# Altium project Sayma_AMC.PrjPcb (part 5 of 18)

## Sheet SDRAM_DDR3_2x16.SchDoc: Sayma AMC
size 420 x 297 mm; $$Internal___BlkDate: 0:12:25_2-9-18; $$Internal_NAME_PLACEHOLDER: a3sheet; $$Internal_Resolution: 00001mm; $$NotCommonProperty_@PRINTORDER: 3; $$NotCommonProperty_FORWARD_PCB: 0; $$NotCommonProperty_REVISION: 0; @DATETIME: 10-1-2003_18:26; @NAME: SDRAM_DDR3_2x16; @SHEET: 1; @SHEETTOTAL: 30; CmpIndex: 131; Drawing Author: G.Kasprowicz; Drawing Number: Sayma AMC; Drawing Project: AMC FMC Carrier Board; Drawing Revision: 2.0; SymIndex: 2141; CheckedBy: P.Kulik,T.Przywozki,W.Ruclo; Author: G.Kasprowicz; CompanyName: WUT ISE; DrawnBy: G.Kasprowicz; Organization: WUT ISE; Address1: PW ISE; Address2: Nowowiejska 15/19 00-665 Warsaw; Address3: gkasprow@gmail.com; DocumentNumber: 28; Revision: 2; SheetNumber: 28; SheetTotal: 32; ModifiedBy: -; CheckedDate: -; Title2: DDR3 - 32bit; DivGrp: WUT ISE; Designer: G.Kasprowicz; ModifiedDate: -; ProjectName: Sensor Box
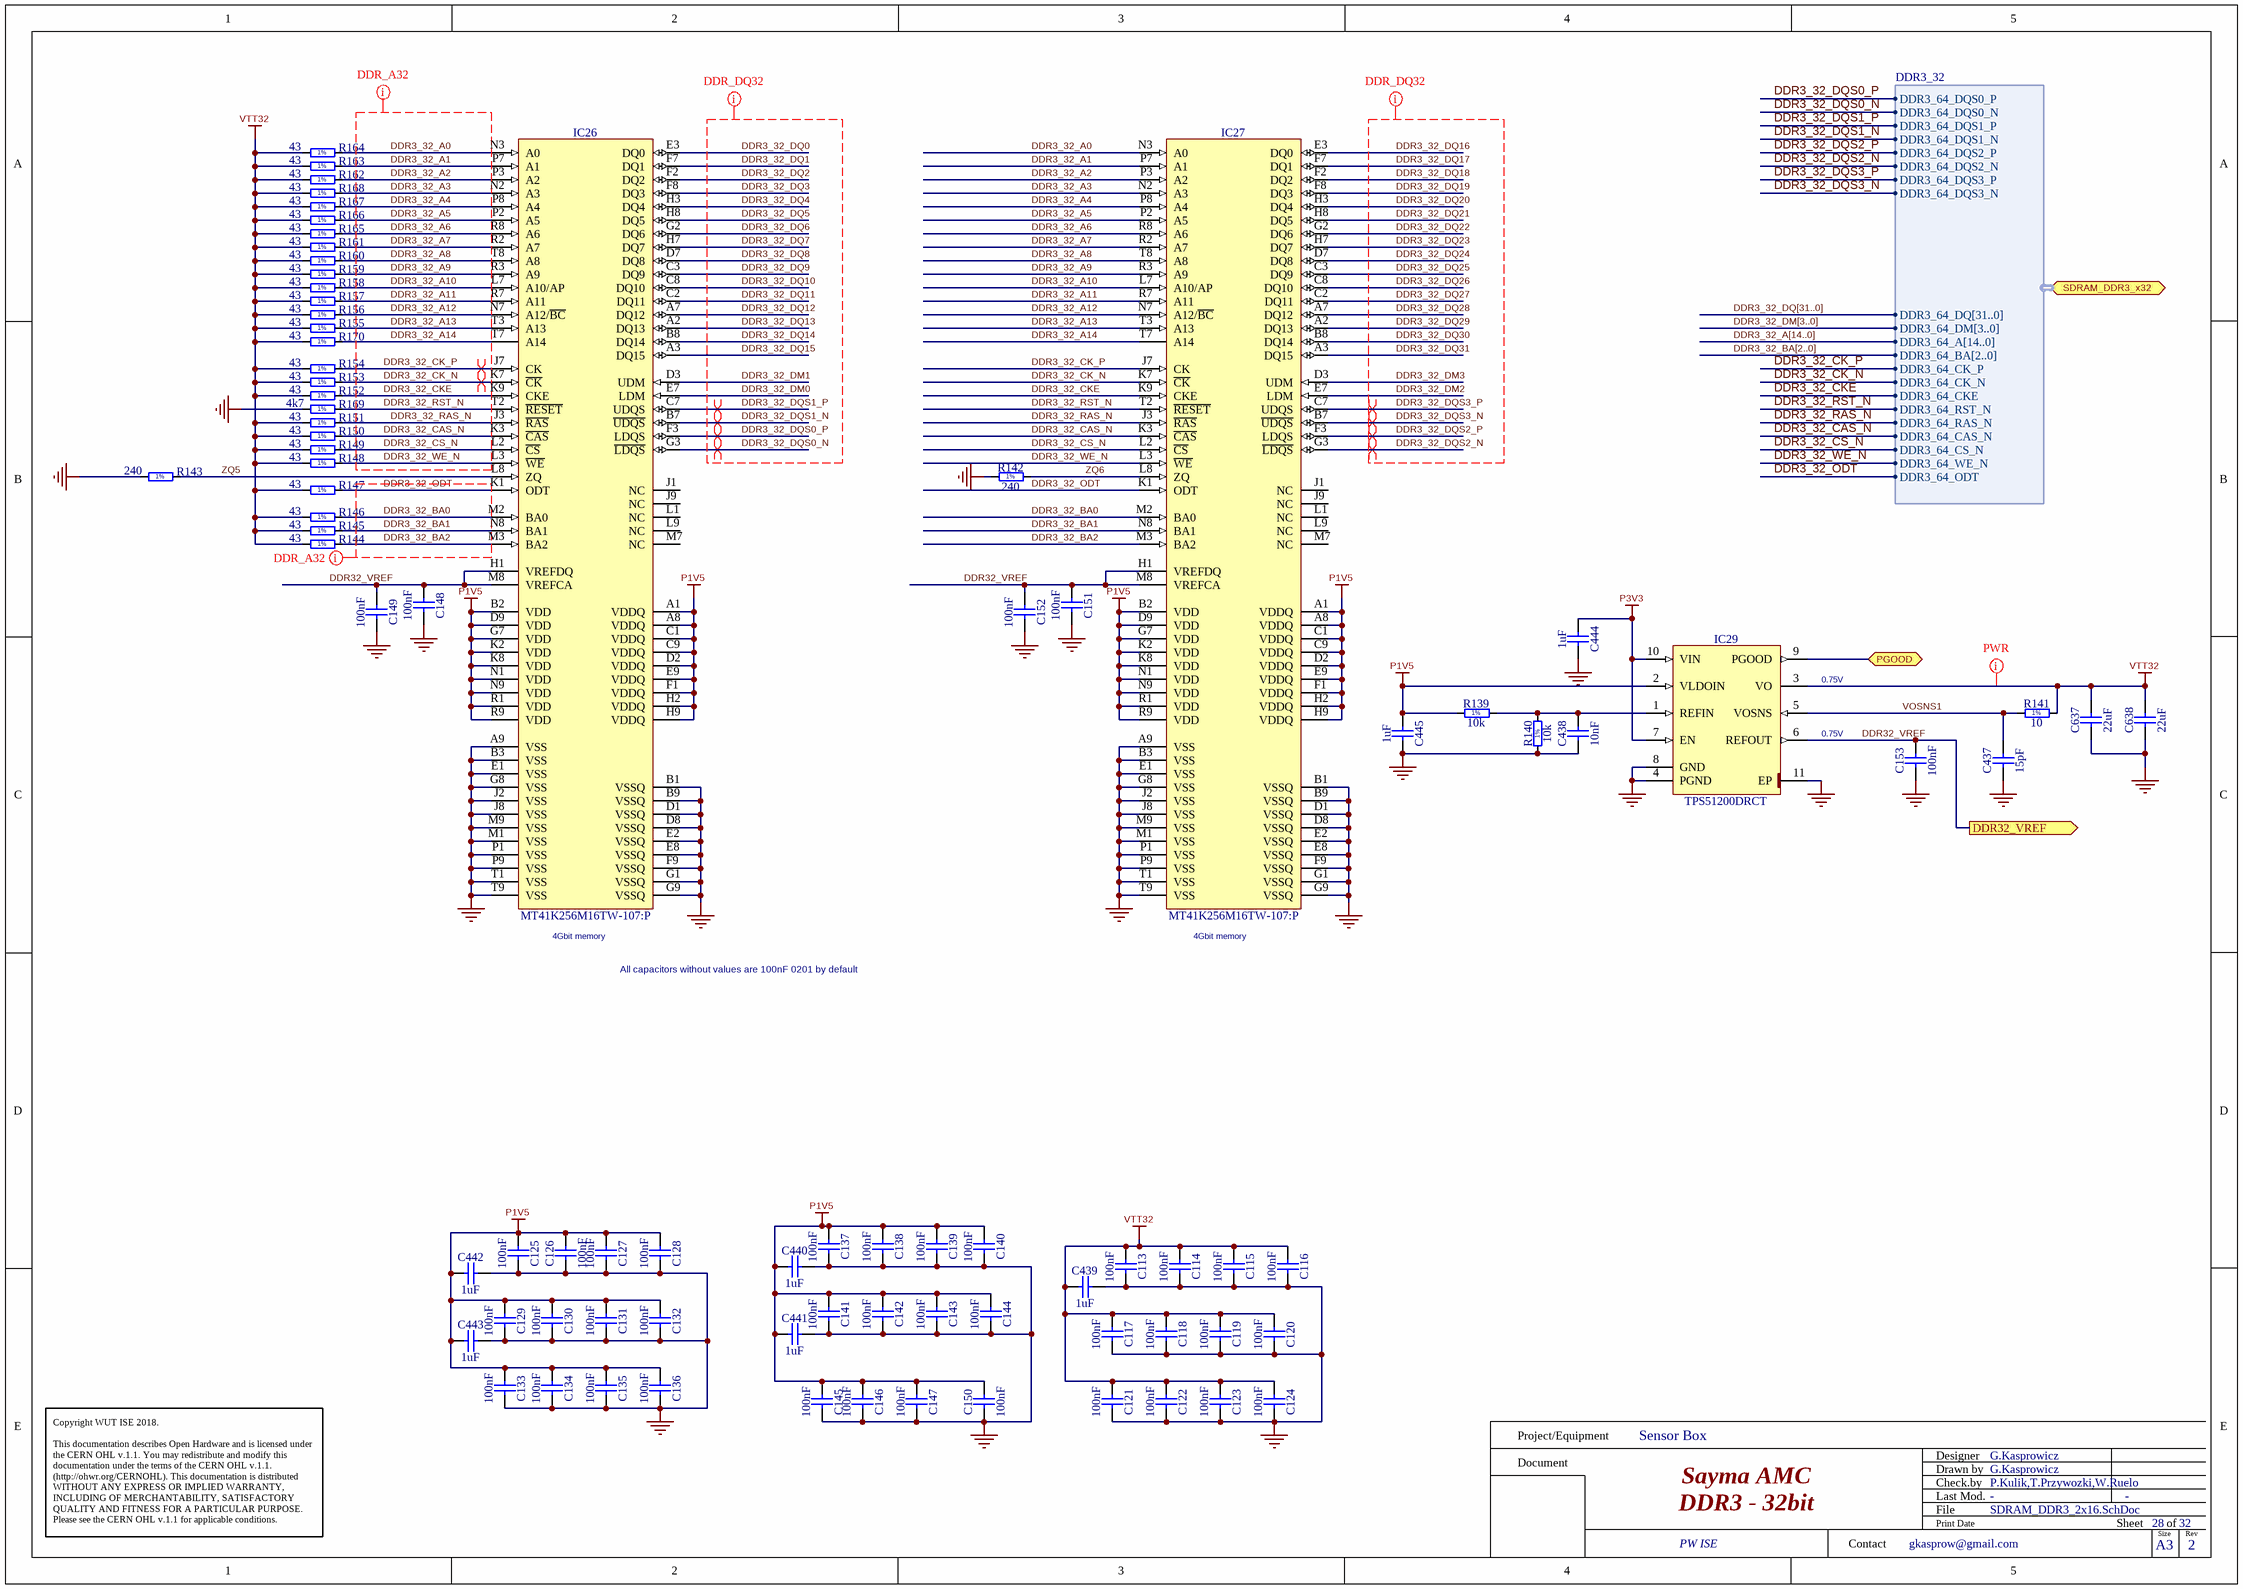
[diagram p6: SDRAM_DDR3_2x16.SchDoc]

### Parts
C113  100nF  [CAPC0603X33N]
C114  100nF  [CAPC0603X33N]
C115  100nF  [CAPC0603X33N]
C116  100nF  [CAPC0603X33N]
C117  100nF  [CAPC0603X33N]
C118  100nF  [CAPC0603X33N]
C119  100nF  [CAPC0603X33N]
C120  100nF  [CAPC0603X33N]
C121  100nF  [CAPC0603X33N]
C122  100nF  [CAPC0603X33N]
C123  100nF  [CAPC0603X33N]
C124  100nF  [CAPC0603X33N]
C125  100nF  [CAPC0603X33N]
C126  100nF  [CAPC0603X33N]
C127  100nF  [CAPC0603X33N]
C128  100nF  [CAPC0603X33N]
C129  100nF  [CAPC0603X33N]
C130  100nF  [CAPC0603X33N]
C131  100nF  [CAPC0603X33N]
C132  100nF  [CAPC0603X33N]
C133  100nF  [CAPC0603X33N]
C134  100nF  [CAPC0603X33N]
C135  100nF  [CAPC0603X33N]
C136  100nF  [CAPC0603X33N]
C137  100nF  [CAPC0603X33N]
C138  100nF  [CAPC0603X33N]
C139  100nF  [CAPC0603X33N]
C140  100nF  [CAPC0603X33N]
C141  100nF  [CAPC0603X33N]
C142  100nF  [CAPC0603X33N]
C143  100nF  [CAPC0603X33N]
C144  100nF  [CAPC0603X33N]
C145  100nF  [CAPC0603X33N]
C146  100nF  [CAPC0603X33N]
C147  100nF  [CAPC0603X33N]
C148  100nF  [CAPC0603X33N]
C149  100nF  [CAPC0603X33N]
C150  100nF  [CAPC0603X33N]
C151  100nF  [CAPC0603X33N]
C152  100nF  [CAPC0603X33N]
C153  100nF  [CAPC0603X33N]
C437  15pF  [CAPC1005X55N]
C438  10nF  [CAPC1005X55N]
C439  1uF  [CAPC1005X55N]
C440  1uF  [CAPC1005X55N]
C441  1uF  [CAPC1005X55N]
C442  1uF  [CAPC1005X55N]
C443  1uF  [CAPC1005X55N]
C444  1uF  [CAPC1005X55N]
C445  1uF  [CAPC1005X55N]
C637  22uF  [CAPC2012X135N]
C638  22uF  [CAPC2012X135N]
IC26  MT41K256M16TW-107:P  [BGA96C80P9X16_800X1400X120]
IC27  MT41K256M16TW-107:P  [BGA96C80P9X16_800X1400X120]
IC29  TPS51200DRCT  [TEXAS_DRC (S-PVSON-N10)]
R139  10k  [RESC1005X40N]
R140  10k  [RESC1005X40N]
R141  10  [RESC1005X40N]
R142  240  [RESC1005X40N]
R143  240  [RESC1005X40N]
R144  43  [RESC1005X40N]
R145  43  [RESC1005X40N]
R146  43  [RESC1005X40N]
R147  43  [RESC1005X40N]
R148  43  [RESC1005X40N]
R149  43  [RESC1005X40N]
R150  43  [RESC1005X40N]
R151  43  [RESC1005X40N]
R152  43  [RESC1005X40N]
R153  43  [RESC1005X40N]
R154  43  [RESC1005X40N]
R155  43  [RESC1005X40N]
R156  43  [RESC1005X40N]
R157  43  [RESC1005X40N]
R158  43  [RESC1005X40N]
R159  43  [RESC1005X40N]
R160  43  [RESC1005X40N]
R161  43  [RESC1005X40N]
R162  43  [RESC1005X40N]
R163  43  [RESC1005X40N]
R164  43  [RESC1005X40N]
R165  43  [RESC1005X40N]
R166  43  [RESC1005X40N]
R167  43  [RESC1005X40N]
R168  43  [RESC1005X40N]
R169  4k7  [RESC1005X40N]
R170  43  [RESC1005X40N]

### Ports
DDR32_VREF (out), PGOOD (bidir), SDRAM_DDR3_x32 (bidir, harness DDR3_32)

### Harnesses
DDR3_32: DDR3_64_DQS0_P, DDR3_64_DQS0_N, DDR3_64_DQS1_P, DDR3_64_DQS1_N, DDR3_64_DQS2_P, DDR3_64_DQS2_N, DDR3_64_DQS3_P, DDR3_64_DQS3_N, DDR3_64_DQ[31..0], DDR3_64_DM[3..0], DDR3_64_A[14..0], DDR3_64_BA[2..0], DDR3_64_CK_P, DDR3_64_CK_N, DDR3_64_CKE, DDR3_64_RST_N, DDR3_64_RAS_N, DDR3_64_CAS_N, DDR3_64_CS_N, DDR3_64_WE_N, DDR3_64_ODT

### Nets
GND: C113.2 C114.2 C115.2 C116.2 C117.2 C118.2 C119.2 C120.2 C121.2 C122.2 C123.2 C124.2 C125.2 C126.2 C127.2 C128.2 C129.2 C130.2 C131.2 C132.2 C133.2 C134.2 C135.2 C136.2 C137.2 C138.2 C139.2 C140.2 C141.2 C142.2 C143.2 C144.2 C145.2 C146.2 C147.2 C148.2 C149.2 C150.1 C151.2 C152.2 C153.1 C437.1 C438.1 C439.2 C440.2 C441.2 C442.2 C443.2 C444.2 C445.2 C637.1 C638.1 IC26.A9(VSS) IC26.B1(VSSQ) IC26.B3(VSS) IC26.B9(VSSQ) IC26.D1(VSSQ) IC26.D8(VSSQ) IC26.E1(VSS) IC26.E2(VSSQ) IC26.E8(VSSQ) IC26.F9(VSSQ) IC26.G1(VSSQ) IC26.G8(VSS) IC26.G9(VSSQ) IC26.J2(VSS) IC26.J8(VSS) IC26.M1(VSS) IC26.M9(VSS) IC26.P1(VSS) IC26.P9(VSS) IC26.T1(VSS) IC26.T9(VSS) IC27.A9(VSS) IC27.B1(VSSQ) IC27.B3(VSS) IC27.B9(VSSQ) IC27.D1(VSSQ) IC27.D8(VSSQ) IC27.E1(VSS) IC27.E2(VSSQ) IC27.E8(VSSQ) IC27.F9(VSSQ) IC27.G1(VSSQ) IC27.G8(VSS) IC27.G9(VSSQ) IC27.J2(VSS) IC27.J8(VSS) IC27.M1(VSS) IC27.M9(VSS) IC27.P1(VSS) IC27.P9(VSS) IC27.T1(VSS) IC27.T9(VSS) IC29.4(PGND) IC29.8(GND) IC29.11(EP) R140.1 R142.1 R143.1 R169.1
P1V5: C125.1 C126.1 C127.1 C128.1 C129.1 C130.1 C131.1 C132.1 C133.1 C134.1 C135.1 C136.1 C137.1 C138.1 C139.1 C140.1 C141.1 C142.1 C143.1 C144.1 C145.1 C146.1 C147.1 C150.2 C440.1 C441.1 C442.1 C443.1 C445.1 IC26.A1(VDDQ) IC26.A8(VDDQ) IC26.B2(VDD) IC26.C1(VDDQ) IC26.C9(VDDQ) IC26.D2(VDDQ) IC26.D9(VDD) IC26.E9(VDDQ) IC26.F1(VDDQ) IC26.G7(VDD) IC26.H2(VDDQ) IC26.H9(VDDQ) IC26.K2(VDD) IC26.K8(VDD) IC26.N1(VDD) IC26.N9(VDD) IC26.R1(VDD) IC26.R9(VDD) IC27.A1(VDDQ) IC27.A8(VDDQ) IC27.B2(VDD) IC27.C1(VDDQ) IC27.C9(VDDQ) IC27.D2(VDDQ) IC27.D9(VDD) IC27.E9(VDDQ) IC27.F1(VDDQ) IC27.G7(VDD) IC27.H2(VDDQ) IC27.H9(VDDQ) IC27.K2(VDD) IC27.K8(VDD) IC27.N1(VDD) IC27.N9(VDD) IC27.R1(VDD) IC27.R9(VDD) IC29.2(VLDOIN) R139.1
P3V3: C444.1 IC29.7(EN) IC29.10(VIN)
VTT32: C113.1 C114.1 C115.1 C116.1 C117.1 C118.1 C119.1 C120.1 C121.1 C122.1 C123.1 C124.1 C439.1 C637.2 C638.2 IC29.3(VO) R141.2 R144.1 R145.1 R146.1 R147.1 R148.1 R149.1 R150.1 R151.1 R152.1 R153.1 R154.1 R155.1 R156.1 R157.1 R158.1 R159.1 R160.1 R161.1 R162.1 R163.1 R164.1 R165.1 R166.1 R167.1 R168.1 R170.1
DDR3_32_A0: IC26.N3(A0) IC27.N3(A0) R164.2
DDR3_32_A1: IC26.P7(A1) IC27.P7(A1) R163.2
DDR3_32_A2: IC26.P3(A2) IC27.P3(A2) R162.2
DDR3_32_A3: IC26.N2(A3) IC27.N2(A3) R168.2
DDR3_32_A4: IC26.P8(A4) IC27.P8(A4) R167.2
DDR3_32_A5: IC26.P2(A5) IC27.P2(A5) R166.2
DDR3_32_A6: IC26.R8(A6) IC27.R8(A6) R165.2
DDR3_32_A7: IC26.R2(A7) IC27.R2(A7) R161.2
DDR3_32_A8: IC26.T8(A8) IC27.T8(A8) R160.2
DDR3_32_A9: IC26.R3(A9) IC27.R3(A9) R159.2
DDR3_32_A10: IC26.L7(A10/AP) IC27.L7(A10/AP) R158.2
DDR3_32_A11: IC26.R7(A11) IC27.R7(A11) R157.2
DDR3_32_A12: IC26.N7(A12/~{BC}) IC27.N7(A12/~{BC}) R156.2
DDR3_32_A13: IC26.T3(A13) IC27.T3(A13) R155.2
DDR3_32_A14: IC26.T7(A14) IC27.T7(A14) R170.2
DDR3_32_BA0: IC26.M2(BA0) IC27.M2(BA0) R146.2
DDR3_32_BA1: IC26.N8(BA1) IC27.N8(BA1) R145.2
DDR3_32_BA2: IC26.M3(BA2) IC27.M3(BA2) R144.2
DDR3_32_CAS_N: IC26.K3(~{CAS}) IC27.K3(~{CAS}) R150.2 ; port SDRAM_DDR3_x32.DDR3_64_CAS_N
DDR3_32_CK_N: IC26.K7(~{CK}) IC27.K7(~{CK}) R153.2 ; port SDRAM_DDR3_x32.DDR3_64_CK_N
DDR3_32_CK_P: IC26.J7(CK) IC27.J7(CK) R154.2 ; port SDRAM_DDR3_x32.DDR3_64_CK_P
DDR3_32_CKE: IC26.K9(CKE) IC27.K9(CKE) R152.2 ; port SDRAM_DDR3_x32.DDR3_64_CKE
DDR3_32_CS_N: IC26.L2(~{CS}) IC27.L2(~{CS}) R149.2 ; port SDRAM_DDR3_x32.DDR3_64_CS_N
DDR3_32_DM0: IC26.E7(LDM)
DDR3_32_DM1: IC26.D3(UDM)
DDR3_32_DM2: IC27.E7(LDM)
DDR3_32_DM3: IC27.D3(UDM)
DDR3_32_DQ0: IC26.E3(DQ0)
DDR3_32_DQ1: IC26.F7(DQ1)
DDR3_32_DQ2: IC26.F2(DQ2)
DDR3_32_DQ3: IC26.F8(DQ3)
DDR3_32_DQ4: IC26.H3(DQ4)
DDR3_32_DQ5: IC26.H8(DQ5)
DDR3_32_DQ6: IC26.G2(DQ6)
DDR3_32_DQ7: IC26.H7(DQ7)
DDR3_32_DQ8: IC26.D7(DQ8)
DDR3_32_DQ9: IC26.C3(DQ9)
DDR3_32_DQ10: IC26.C8(DQ10)
DDR3_32_DQ11: IC26.C2(DQ11)
DDR3_32_DQ12: IC26.A7(DQ12)
DDR3_32_DQ13: IC26.A2(DQ13)
DDR3_32_DQ14: IC26.B8(DQ14)
DDR3_32_DQ15: IC26.A3(DQ15)
DDR3_32_DQ16: IC27.E3(DQ0)
DDR3_32_DQ17: IC27.F7(DQ1)
DDR3_32_DQ18: IC27.F2(DQ2)
DDR3_32_DQ19: IC27.F8(DQ3)
DDR3_32_DQ20: IC27.H3(DQ4)
DDR3_32_DQ21: IC27.H8(DQ5)
DDR3_32_DQ22: IC27.G2(DQ6)
DDR3_32_DQ23: IC27.H7(DQ7)
DDR3_32_DQ24: IC27.D7(DQ8)
DDR3_32_DQ25: IC27.C3(DQ9)
DDR3_32_DQ26: IC27.C8(DQ10)
DDR3_32_DQ27: IC27.C2(DQ11)
DDR3_32_DQ28: IC27.A7(DQ12)
DDR3_32_DQ29: IC27.A2(DQ13)
DDR3_32_DQ30: IC27.B8(DQ14)
DDR3_32_DQ31: IC27.A3(DQ15)
DDR3_32_DQS0_N: IC26.G3(~{LDQS}) ; port SDRAM_DDR3_x32.DDR3_64_DQS0_N
DDR3_32_DQS0_P: IC26.F3(LDQS) ; port SDRAM_DDR3_x32.DDR3_64_DQS0_P
DDR3_32_DQS1_N: IC26.B7(~{UDQS}) ; port SDRAM_DDR3_x32.DDR3_64_DQS1_N
DDR3_32_DQS1_P: IC26.C7(UDQS) ; port SDRAM_DDR3_x32.DDR3_64_DQS1_P
DDR3_32_DQS2_N: IC27.G3(~{LDQS}) ; port SDRAM_DDR3_x32.DDR3_64_DQS2_N
DDR3_32_DQS2_P: IC27.F3(LDQS) ; port SDRAM_DDR3_x32.DDR3_64_DQS2_P
DDR3_32_DQS3_N: IC27.B7(~{UDQS}) ; port SDRAM_DDR3_x32.DDR3_64_DQS3_N
DDR3_32_DQS3_P: IC27.C7(UDQS) ; port SDRAM_DDR3_x32.DDR3_64_DQS3_P
DDR3_32_ODT: IC26.K1(ODT) IC27.K1(ODT) R147.2 ; port SDRAM_DDR3_x32.DDR3_64_ODT
DDR3_32_RAS_N: IC26.J3(~{RAS}) IC27.J3(~{RAS}) R151.2 ; port SDRAM_DDR3_x32.DDR3_64_RAS_N
DDR3_32_RST_N: IC26.T2(~{RESET}) IC27.T2(~{RESET}) R169.2 ; port SDRAM_DDR3_x32.DDR3_64_RST_N
DDR3_32_WE_N: IC26.L3(~{WE}) IC27.L3(~{WE}) R148.2 ; port SDRAM_DDR3_x32.DDR3_64_WE_N
DDR32_VREF: C148.1 C149.1 C151.1 C152.1 C153.2 IC26.H1(VREFDQ) IC26.M8(VREFCA) IC27.H1(VREFDQ) IC27.M8(VREFCA) IC29.6(REFOUT) ; port DDR32_VREF
SDRAM_PGOOD: IC29.9(PGOOD) ; port PGOOD
VOSNS1: C437.2 IC29.5(VOSNS) R141.1
ZQ5: IC26.L8(ZQ) R143.2
ZQ6: IC27.L8(ZQ) R142.2
NetC438_2: C438.2 IC29.1(REFIN) R139.2 R140.2

Not connected (* = marked no-connect by the designer): IC26 J1(NC) J9(NC) L1(NC) L9(NC) M7(NC); IC27 J1(NC) J9(NC) L1(NC) L9(NC) M7(NC)

### Buses and harness runs
bus DDR3_32_A[14..0]
bus DDR3_32_BA[2..0]
bus DDR3_32_DM[3..0]
bus DDR3_32_DQ[31..0]

### Layout directives
differential pair: DDR3_32_CK_N, DDR3_32_CK_P, DDR3_32_DQS0_N, DDR3_32_DQS0_P, DDR3_32_DQS1_N, DDR3_32_DQS1_P, DDR3_32_DQS2_N, DDR3_32_DQS2_P, DDR3_32_DQS3_N, DDR3_32_DQS3_P
net class DDR_DQ32: DDR3_32_DM0, DDR3_32_DM1, DDR3_32_DM2, DDR3_32_DM3, DDR3_32_DQ0, DDR3_32_DQ1, DDR3_32_DQ2, DDR3_32_DQ3, DDR3_32_DQ4, DDR3_32_DQ5, DDR3_32_DQ6, DDR3_32_DQ7, DDR3_32_DQ8, DDR3_32_DQ9, DDR3_32_DQ10, DDR3_32_DQ11, DDR3_32_DQ12, DDR3_32_DQ13, DDR3_32_DQ14, DDR3_32_DQ15, DDR3_32_DQ16, DDR3_32_DQ17, DDR3_32_DQ18, DDR3_32_DQ19, DDR3_32_DQ20, DDR3_32_DQ21, DDR3_32_DQ22, DDR3_32_DQ23, DDR3_32_DQ24, DDR3_32_DQ25, DDR3_32_DQ26, DDR3_32_DQ27, DDR3_32_DQ28, DDR3_32_DQ29, DDR3_32_DQ30, DDR3_32_DQ31, DDR3_32_DQS0_N, DDR3_32_DQS0_P, DDR3_32_DQS1_N, DDR3_32_DQS1_P, DDR3_32_DQS2_N, DDR3_32_DQS2_P, DDR3_32_DQS3_N, DDR3_32_DQS3_P
net class DDR_A32: DDR3_32_A0, DDR3_32_A1, DDR3_32_A2, DDR3_32_A3, DDR3_32_A4, DDR3_32_A5, DDR3_32_A6, DDR3_32_A7, DDR3_32_A8, DDR3_32_A9, DDR3_32_A10, DDR3_32_A11, DDR3_32_A12, DDR3_32_A13, DDR3_32_A14, DDR3_32_BA0, DDR3_32_BA1, DDR3_32_BA2, DDR3_32_CAS_N, DDR3_32_CK_N, DDR3_32_CK_P, DDR3_32_CKE, DDR3_32_CS_N, DDR3_32_ODT, DDR3_32_RAS_N, DDR3_32_RST_N, DDR3_32_WE_N
net class PWR: VTT32

### Notes on the sheet
- (near IC29) 0.75V
- (near IC26) 4Gbit memory
- (near IC27) 4Gbit memory
- All capacitors without values are 100nF 0201 by default
- Project/Equipment
- Document
- Designer
- Drawn by
- Check.by
- Copyright WUT ISE 2018.
  This documentation describes Open Hardware and is licensed under the CERN OHL v.1.1. You may redistribute and modify this documentation under the terms of the CERN OHL v.1.1. (http://ohwr.org/CERNOHL). This documentation is distributed WITHOUT ANY EXPRESS OR IMPLIED WARRANTY, INCLUDING OF MERCHANTABILITY, SATISFACTORY QUALITY AND FITNESS FOR A PARTICULAR PURPOSE. Please see the CERN OHL v.1.1 for applicable conditions.
- Contact
- File
- Last Mod.
- Print Date
- Sheet
- Size
- A3
- of
- Rev
- (in symbol R0402_4K7_1%_0.0625W_100PPM) 1%
- (in symbol R0402_10K_1%_0.0625W_100PPM) 1%
- (in symbol R0402_10R_1%_0.0625W_200PPM) 1%
- (in symbol R0402_43R_1%_0.0625W_100PPM) 1%
- (in symbol R0402_240R_1%_0.0625W_100PPM) 1%

### Library data of the parts
C113-C153 = CC0201_100NF_6.3V_10%_X5R: Non-polarised capacitor; Manufacturer: GENERIC; Part Description: SMD Multilayer Chip Ceramic Capacitor; Manufacturer1 Part Number: 02016D104KAT2A; Tolerance: ±10%; Voltage: 6.3V; TC: X5R; Manufacturer Part Number: CC0201_100NF_6.3V_10%_X5R; Part Number: CC0201_100NF_6.3V_10%_X5R; Value: 100nF; Component Kind: Standard; Component Type: Standard; Pin Count: 2; Status: Not Recommended; Case: 0201; Mounted: Yes; Socket: No; SMD: Yes; Sense: No; Manufacturer1 Example: AVX; Manufacturer1 ComponentHeight: 0.33mm; HelpURL: \\cern.ch\dfs\Applications\Altium\Datasheets\CC0201_X5R_AVX.pdf; Author: CERN DEM JLC; CreateDate: 03.12.2007; LatestRevisionDate: 03.12.2007
C437 = CC0402_15PF_50V_5%_C0G: Non-polarised capacitor; Manufacturer: GENERIC; Part Description: SMD Multilayer Chip Ceramic Capacitor; Manufacturer1 Part Number: C0402C150J5GACTU; Tolerance: ±5%; Voltage: 50V; TC: C0G/NP0; Manufacturer Part Number: CC0402_15PF_50V_5%_C0G; Part Number: CC0402_15PF_50V_5%_C0G; Value: 15pF; Component Kind: Standard; Component Type: Standard; Pin Count: 2; Status: Preferred; Case: 0402; Mounted: Yes; Socket: No; SMD: Yes; Sense: No; Manufacturer1 Example: KEMET; Manufacturer1 ComponentHeight: 0.55mm; HelpURL: \\cern.ch\dfs\Applications\Altium\Datasheets\CC0805_C0G_KEMET_(Commercial Grade).pdf; Author: CERN DEM JLC; CreateDate: 03.12.2007; LatestRevisionDate: 22.04.2015
C438 = CC0402_10NF_25V_10%_X7R: Non-polarised capacitor; Manufacturer: GENERIC; Part Description: SMD Multilayer Chip Ceramic Capacitor; Manufacturer1 Part Number: C1005X7R1E103KT; Tolerance: ±10%; Voltage: 25V; TC: X7R; Manufacturer Part Number: CC0402_10NF_25V_10%_X7R; Part Number: CC0402_10NF_25V_10%_X7R; Value: 10nF; Component Kind: Standard; Component Type: Standard; Pin Count: 2; Status: Preferred; Case: 0402; Mounted: Yes; Socket: No; SMD: Yes; Sense: No; Manufacturer1 Example: TDK; Manufacturer1 ComponentHeight: 0.55mm; HelpURL: \\cern.ch\dfs\Applications\Altium\Datasheets\CC0402_X7R_TDK_C.pdf; Author: CERN DEM JLC; CreateDate: 25.10.2012; LatestRevisionDate: 25.10.2012
C439-C445 = CC0402_1UF_16V_10%_X5R: Non-polarised capacitor; Manufacturer: GENERIC; Part Description: SMD Multilayer Chip Ceramic Capacitor; Manufacturer1 Part Number: C1005X5R1C105KT; Tolerance: ±10%; Voltage: 16V; TC: X5R; Manufacturer Part Number: CC0402_1UF_16V_10%_X5R; Part Number: CC0402_1UF_16V_10%_X5R; Value: 1uF; Component Kind: Standard; Component Type: Standard; Pin Count: 2; Status: Preferred; Case: 0402; Mounted: Yes; Socket: No; SMD: Yes; Sense: No; Manufacturer1 Example: TDK; Manufacturer1 ComponentHeight: 0.55mm; HelpURL: \\cern.ch\dfs\Applications\Altium\Datasheets\CC0402_X5R_TDK_C.pdf; Author: CERN DEM JLC; CreateDate: 25.10.2012; LatestRevisionDate: 25.10.2012
C637 C638 = CC0805_22UF_10V_+80%-20%_Y5V: Non-polarised capacitor; Manufacturer: GENERIC; Part Description: SMD Multilayer Chip Ceramic Capacitor; Manufacturer1 Part Number: 2222 241 19881; Voltage: 10V; TC: Y5V; Manufacturer Part Number: CC0805_22UF_10V_+80%-20%_Y5V; Part Number: CC0805_22UF_10V_+80%-20%_Y5V; Tolerance: +80% -20%; Value: 22uF; Component Kind: Standard; Component Type: Standard; Pin Count: 2; Status: Preferred; Case: 0805; Mounted: Yes; Socket: No; SMD: Yes; Sense: No; Manufacturer1 Example: PHYCOMP; Manufacturer1 ComponentHeight: 1.45mm; HelpURL: \\cern.ch\dfs\Applications\Altium\Datasheets\CC0805_Y5V_PHYCOMP.pdf; Author: CERN DEM JLC; CreateDate: 03.12.2007; LatestRevisionDate: 03.12.2007
IC26 IC27 = MT41K256M16TW-107:P: 32 Meg x 16 x 8 Banks DDR3L SDRAM; Manufacturer: MICRON TECHNOLOGY; Part Description: +1.5V, 4Gb (32Meg x 16 x 8 banks) DDR3L SDRAM; PressFit: No; Bonding: No; Manufacturer Part Number: MT41K256M16TW-107:P; Part Number: MT41K256M16TW-107:P; Component Kind: Standard; Component Type: Standard; Device: MT41K256M16TW-107:P; PackageDescription: BGA 0.8mm, Pitch, Square 96 Pin, 9 Columns x 16 Rows, Body 14mm X 8mm X 1.2mm H; Pin Count: 96; Case: BGA96; Mounted: Yes; Socket: No; SMD: Yes; Sense: No; ComponentHeight: 1.2mm; HelpURL: \\cern.ch\dfs\Applications\Altium\Datasheets\MT41K256M16TW-107-P.pdf; Author: CERN DEM MR; CreateDate: 14.12.2015; LatestRevisionDate: 14.12.2015
IC29 = TPS51200DRCT: Sink/Source DDR Termination Regulator; Manufacturer: TEXAS INSTRUMENTS; Part Description: 3.3V Sink/Source DDR Termination Regulator; PressFit: No; Bonding: No; Manufacturer Part Number: TPS51200DRCT; PackageDescription: SON, 0.50mm Pitch, 10-pin, 3.00mm W  X 3.00mm L X 1.00mm Height, (w/thermal tab 1.75 X 2.50 mm); Part Number: TPS51200DRCT; Component Kind: Standard; Component Type: Standard; Device: TPS51200DRCT; Pin Count: 11; Case: SON10; Mounted: Yes; Socket: No; SMD: Yes; Sense: No; ComponentHeight: 1mm; HelpURL: \\cern.ch\dfs\Applications\Altium\Datasheets\TPS51200DRCT.pdf; Author: CERN DEM JLC; CreateDate: 03.02.2010; LatestRevisionDate: 06.11.2013
R139 R140 = R0402_10K_1%_0.0625W_100PPM: Resistor - 1%; Manufacturer: GENERIC; Part Description: General Purpose Thick Film Chip Resistor; Manufacturer1 Part Number: 232270671003L; TC: ±100ppm/°C; PressFit: No; Manufacturer Part Number: R0402_10K_1%_0.0625W_100PPM; Part Number: R0402_10K_1%_0.0625W_100PPM; Tolerance: ±1%; Value: 10k; Component Kind: Standard; Component Type: Standard; Pin Count: 2; Status: Not Recommended; Power: 0.0625W; Case: 0402; Mounted: Yes; Sense: No; Socket: No; SMD: Yes; Manufacturer1 Example: YAGEO PHYCOMP; Manufacturer1 ComponentHeight: 0.4mm; HelpURL: \\cern.ch\dfs\Applications\Altium\Datasheets\R0402_Phycomp_RC0402.pdf; Author: CERN DEM JLC; CreateDate: 03.12.2007; LatestRevisionDate: 17.10.2012
R141 = R0402_10R_1%_0.0625W_200PPM: Resistor - 1%; Manufacturer: GENERIC; Part Description: General Purpose Thick Film Chip Resistor; Manufacturer1 Part Number: 232270671009L; TC: ±200ppm/°C; PressFit: No; Manufacturer Part Number: R0402_10R_1%_0.0625W_200PPM; Part Number: R0402_10R_1%_0.0625W_200PPM; Tolerance: ±1%; Value: 10; Component Kind: Standard; Component Type: Standard; Pin Count: 2; Status: Not Recommended; Power: 0.0625W; Case: 0402; Mounted: Yes; Sense: No; Socket: No; SMD: Yes; Manufacturer1 Example: YAGEO PHYCOMP; Manufacturer1 ComponentHeight: 0.4mm; HelpURL: \\cern.ch\dfs\Applications\Altium\Datasheets\R0402_Phycomp_RC0402.pdf; Author: CERN DEM JLC; CreateDate: 24.06.2009; LatestRevisionDate: 17.10.2012
R142 R143 = R0402_240R_1%_0.0625W_100PPM: Resistor - 1%; Manufacturer: GENERIC; Part Description: General Purpose Thick Film Chip Resistor; Manufacturer1 Part Number: 232270672401L; TC: ±100ppm/°C; PressFit: No; Manufacturer Part Number: R0402_240R_1%_0.0625W_100PPM; Part Number: R0402_240R_1%_0.0625W_100PPM; Tolerance: ±1%; Value: 240; Component Kind: Standard; Component Type: Standard; Pin Count: 2; Status: Not Recommended; Power: 0.0625W; Case: 0402; Mounted: Yes; Sense: No; Socket: No; SMD: Yes; Manufacturer1 Example: YAGEO PHYCOMP; Manufacturer1 ComponentHeight: 0.4mm; HelpURL: \\cern.ch\dfs\Applications\Altium\Datasheets\R0402_Phycomp_RC0402.pdf; Author: CERN DEM JLC; CreateDate: 03.12.2007; LatestRevisionDate: 17.10.2012
R144-R168 R170 = R0402_43R_1%_0.0625W_100PPM: Resistor - 1%; Manufacturer: GENERIC; Part Description: General Purpose Thick Film Chip Resistor; Manufacturer1 Part Number: 232270674309L; TC: ±100ppm/°C; PressFit: No; Manufacturer Part Number: R0402_43R_1%_0.0625W_100PPM; Part Number: R0402_43R_1%_0.0625W_100PPM; Tolerance: ±1%; Value: 43; Component Kind: Standard; Component Type: Standard; Pin Count: 2; Status: Not Recommended; Power: 0.0625W; Case: 0402; Mounted: Yes; Sense: No; Socket: No; SMD: Yes; Manufacturer1 Example: YAGEO PHYCOMP; Manufacturer1 ComponentHeight: 0.4mm; HelpURL: \\cern.ch\dfs\Applications\Altium\Datasheets\R0402_Phycomp_RC0402.pdf; Author: CERN DEM JLC; CreateDate: 03.12.2007; LatestRevisionDate: 17.10.2012
R169 = R0402_4K7_1%_0.0625W_100PPM: Resistor - 1%; Manufacturer: GENERIC; Part Description: General Purpose Thick Film Chip Resistor; Manufacturer1 Part Number: 232270674702L; TC: ±100ppm/°C; PressFit: No; Manufacturer Part Number: R0402_4K7_1%_0.0625W_100PPM; Part Number: R0402_4K7_1%_0.0625W_100PPM; Tolerance: ±1%; Value: 4k7; Component Kind: Standard; Component Type: Standard; Pin Count: 2; Status: Not Recommended; Power: 0.0625W; Case: 0402; Mounted: Yes; Sense: No; Socket: No; SMD: Yes; Manufacturer1 Example: YAGEO PHYCOMP; Manufacturer1 ComponentHeight: 0.4mm; HelpURL: \\cern.ch\dfs\Applications\Altium\Datasheets\R0402_Phycomp_RC0402.pdf; Author: CERN DEM JLC; CreateDate: 03.12.2007; LatestRevisionDate: 17.10.2012

## Sheet POWER_Management.SchDoc: Sayma AMC
size 420 x 297 mm; $$Internal___BlkDate: 0:12:25_2-9-18; $$Internal_NAME_PLACEHOLDER: a3sheet; $$Internal_Resolution: 00001mm; $$NotCommonProperty_@NAME: POWER_Management; $$NotCommonProperty_@PRINTORDER: 25; $$NotCommonProperty_@SHEET: 1; $$NotCommonProperty_@SHEETTOTAL: 30; CmpIndex: 14; Drawing Author: G.Kasprowicz; Drawing Number: Sayma AMC; Drawing Project: AMC FMC Carrier Board; Drawing Revision: 2.0; SymIndex: 2141; CheckedBy: P.Kulik,T.Przywozki,W.Ruclo; Author: G.Kasprowicz; CompanyName: WUT ISE; DrawnBy: G.Kasprowicz; Organization: WUT ISE; Address1: PW ISE; Address2: Nowowiejska 15/19 00-665 Warsaw; Address3: gkasprow@gmail.com; DocumentNumber: 12; Revision: 2; SheetNumber: 12; SheetTotal: 32; ModifiedBy: -; CheckedDate: -; Title2: Power entry & management; DivGrp: WUT ISE; Designer: G.Kasprowicz; ModifiedDate: -; ProjectName: Sensor Box
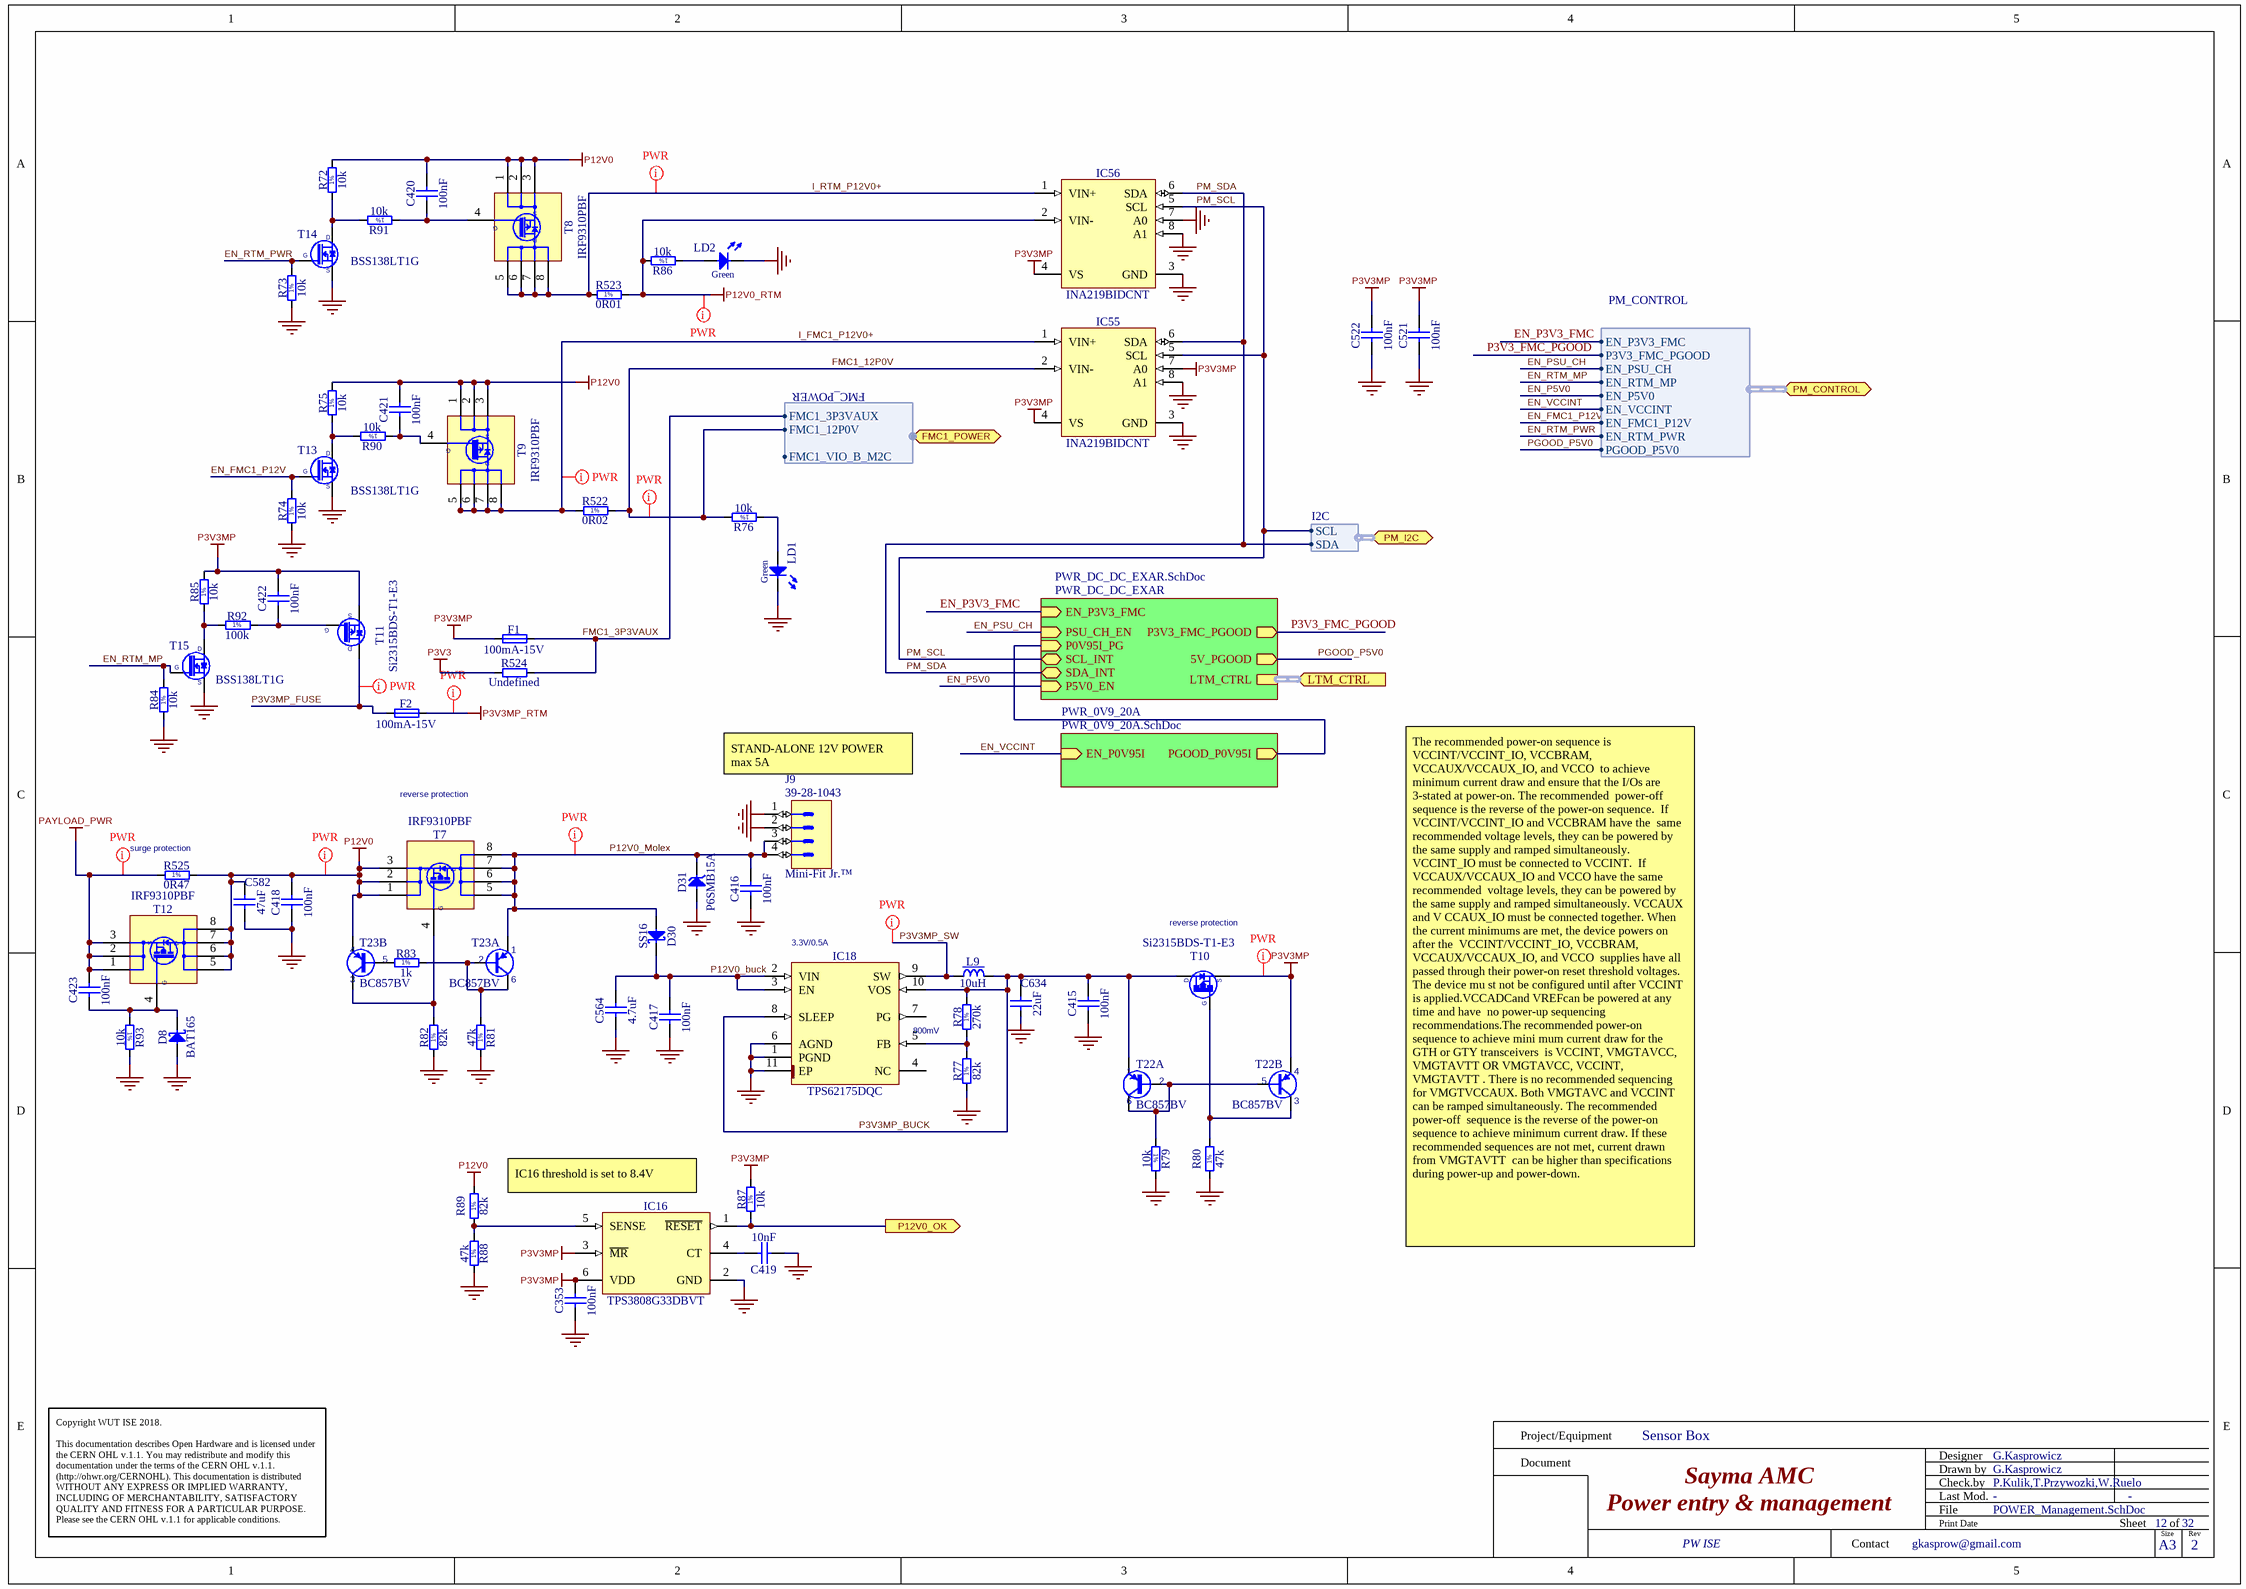
[diagram p7: POWER_Management.SchDoc]

### Parts
C353  100nF  [CAPC1005X55N]
C415  100nF  [CAPC1005X55N]
C416  100nF  [CAPC1005X55N]
C417  100nF  [CAPC1005X55N]
C418  100nF  [CAPC1005X55N]
C419  10nF  [CAPC1005X55N]
C420  100nF  [CAPC1005X55N]
C421  100nF  [CAPC1005X55N]
C422  100nF  [CAPC1005X55N]
C423  100nF  [CAPC1005X55N]
C521  100nF  [CAPC1005X55N]
C522  100nF  [CAPC1005X55N]
C564  4.7uF  [CAPC1709X95N]
C582  47uF  [CAPC3216X180N]
C634  22uF  [CAPC2012X135N]
D8  BAT165  [SOD2512X110N]
D30  SS16  [DIOM5127X229N]
D31  P6SMB15A  [DIOM5436X261N]
F1  100mA-15V  [FUSR_LITTELFUSE_0805L010]
F2  100mA-15V  [FUSR_LITTELFUSE_0805L010]
IC16  TPS3808G33DBVT  [SOT95P280X145-6N]
IC18  TPS62175DQC  [SON50P200X300X80-11N-R94X250]
IC55  INA219BIDCNT  [SOT65P280X145-8N]
IC56  INA219BIDCNT  [SOT65P280X145-8N]
J9  Mini-Fit Jr.™  Manufacturer Part Number: 39-28-1043  [MOLEX_39-28-1043]
L9  10uH  [IND_MURATA-PS_8400]
LD1  Green  [LED_KINGBRIGHT_KPH-1608CGCK]
LD2  Green  [LED_KINGBRIGHT_KPH-1608CGCK]
R72  10k  [RESC1005X40N]
R73  10k  [RESC1005X40N]
R74  10k  [RESC1005X40N]
R75  10k  [RESC1005X40N]
R76  10k  [RESC1005X40N]
R77  82k  [RESC1005X40N]
R78  270k  [RESC1005X40N]
R79  10k  [RESC1005X40N]
R80  47k  [RESC1005X40N]
R81  47k  [RESC1005X40N]
R82  82k  [RESC1005X40N]
R83  1k  [RESC1005X40N]
R84  10k  [RESC1005X40N]
R85  10k  [RESC1005X40N]
R86  10k  [RESC1005X40N]
R87  10k  [RESC1005X40N]
R88  47k  [RESC1005X40N]
R89  82k  [RESC1005X40N]
R90  10k  [RESC1005X40N]
R91  10k  [RESC1005X40N]
R92  100k  [RESC1005X40N]
R93  10k  [RESC1005X40N]
R522  0R02  [RESC_VISHAY_WSL2512_0R007-0R5]
R523  0R01  [RESC_VISHAY_WSL2512_0R007-0R5]
R524  Undefined  [RESC2012X60N]
R525  0R47  [RESC3216X65N]
T7  IRF9310PBF  [SOIC127P600X175-8N]
T8  IRF9310PBF  [SOIC127P600X175-8N]
T9  IRF9310PBF  [SOIC127P600X175-8N]
T10  Si2315BDS-T1-E3  [SOT95P237X112-3N]
T11  Si2315BDS-T1-E3  [SOT95P237X112-3N]
T12  IRF9310PBF  [SOIC127P600X175-8N]
T13  BSS138LT1G  [SOT95P240X110-3N]
T14  BSS138LT1G  [SOT95P240X110-3N]
T15  BSS138LT1G  [SOT95P240X110-3N]
T22  BC857BV  [SOTFL50P160X60-6N]  (parts A,B of 2)
T23  BC857BV  [SOTFL50P160X60-6N]  (parts A,B of 2)

### Sub-sheets
PWR_0V9_20A = PWR_0V9_20A.SchDoc: PGOOD_P0V95I (out), EN_P0V95I (in)  | CmpIndex: 17; SymIndex: 784
PWR_DC_DC_EXAR = PWR_DC_DC_EXAR.SchDoc: PSU_CH_EN (in), P0V95I_PG (in), P5V0_EN (in), 5V_PGOOD (out), SDA_INT (bidir), SCL_INT (bidir), LTM_CTRL (harness LTM_CTRL), P3V3_FMC_PGOOD (out), EN_P3V3_FMC (in)  | CmpIndex: 9; SymIndex: 296

### Ports
FMC1_POWER (bidir, harness FMC_POWER), LTM_CTRL (in, harness LTM_CTRL), P12V0_OK (out), PM_CONTROL (bidir, harness PM_CONTROL), PM_I2C (bidir, harness I2C)

### Harnesses
PM_CONTROL: PGOOD_P5V0, EN_RTM_PWR, EN_FMC1_P12V, EN_VCCINT, EN_P5V0, EN_RTM_MP, EN_PSU_CH, EN_P3V3_FMC, P3V3_FMC_PGOOD
I2C: SCL, SDA
FMC_POWER: FMC1_3P3VAUX, FMC1_12P0V, FMC1_VIO_B_M2C

### Nets
GND: C353.1 C415.1 C416.1 C417.1 C418.1 C419.1 C521.1 C522.1 C564.1 C582.1 C634.1 D8.2(A) D31.2(A) IC16.2(GND) IC18.1(PGND) IC18.6(AGND) IC18.11(EP) IC55.3(GND) IC55.8(A1) IC56.3(GND) IC56.7(A0) IC56.8(A1) J9.1 J9.2 LD1.1(C) LD2.1(C) R73.1 R74.1 R77.1 R79.2 R80.1 R81.1 R82.1 R84.1 R88.1 R93.2 T13.2(S) T14.2(S) T15.2(S)
P3V3: R524.1
P3V3MP: C353.2 C422.2 C521.2 C522.2 F1.1 IC16.3(~{MR}) IC16.6(VDD) IC55.4(VS) IC55.7(A0) IC56.4(VS) R85.2 R87.2 T10.2(S) T11.2(S) T22.4(E)
P3V3MP_RTM: F2.2
P12V0: C418.2 C420.2 C421.2 C582.2 R72.2 R75.2 R89.2 R525.2 T7.1(S) T7.2(S) T7.3(S) T8.1(S) T8.2(S) T8.3(S) T9.1(S) T9.2(S) T9.3(S) T12.5(D) T12.6(D) T12.7(D) T12.8(D) T23.4(E)
P12V0_RTM: IC56.2(VIN-) R86.2 R523.2
PAYLOAD_PWR: C423.2 R525.1 T12.1(S) T12.2(S) T12.3(S)
EN_FMC1_P12V: R74.2 T13.1(G) ; port PM_CONTROL.EN_FMC1_P12V
EN_P3V3_FMC: sheet PWR_DC_DC_EXAR/EN_P3V3_FMC, port PM_CONTROL.EN_P3V3_FMC
EN_P5V0: sheet PWR_DC_DC_EXAR/P5V0_EN, port PM_CONTROL.EN_P5V0
EN_PSU_CH: sheet PWR_DC_DC_EXAR/PSU_CH_EN, port PM_CONTROL.EN_PSU_CH
EN_RTM_MP: R84.2 T15.1(G) ; port PM_CONTROL.EN_RTM_MP
EN_RTM_PWR: R73.2 T14.1(G) ; port PM_CONTROL.EN_RTM_PWR
EN_VCCINT: sheet PWR_0V9_20A/EN_P0V95I, port PM_CONTROL.EN_VCCINT
FMC1_3P3VAUX: F1.2 R524.2 ; port FMC1_POWER.FMC1_3P3VAUX
FMC1_12P0V: IC55.2(VIN-) R76.2 R522.2 ; port FMC1_POWER.FMC1_12P0V
I_FMC1_P12V0+: IC55.1(VIN+) R522.1 T9.5(D) T9.6(D) T9.7(D) T9.8(D)
I_RTM_P12V0+: IC56.1(VIN+) R523.1 T8.5(D) T8.6(D) T8.7(D) T8.8(D)
P0V95I_PG: sheet PWR_DC_DC_EXAR/P0V95I_PG, sheet PWR_0V9_20A/PGOOD_P0V95I
P3V3_FMC_PGOOD: sheet PWR_DC_DC_EXAR/P3V3_FMC_PGOOD, port PM_CONTROL.P3V3_FMC_PGOOD
P3V3MP_BUCK: C415.2 C634.2 IC18.8(SLEEP) IC18.10(VOS) L9.2 R78.2 T10.3(D) T22.1(E)
P3V3MP_FUSE: F2.1 T11.3(D)
P3V3MP_SW: IC18.9(SW) L9.1
P12V0_buck: C417.2 C564.2 D30.1(C) IC18.2(VIN) IC18.3(EN)
P12V0_Molex: C416.2 D30.2(A) D31.1(C) J9.3 J9.4 T7.5(D) T7.6(D) T7.7(D) T7.8(D) T23.1(E)
PGOOD_P5V0: sheet PWR_DC_DC_EXAR/5V_PGOOD, port PM_CONTROL.PGOOD_P5V0
PM_SCL: IC55.5(SCL) IC56.5(SCL) ; sheet PWR_DC_DC_EXAR/SCL_INT, port PM_I2C.SCL
PM_SDA: IC55.6(SDA) IC56.6(SDA) ; sheet PWR_DC_DC_EXAR/SDA_INT, port PM_I2C.SDA
NetC419_2: C419.2 IC16.4(CT)
NetC420_1: C420.1 R91.1 T8.4(S)
NetC421_1: C421.1 R90.1 T9.4(S)
NetC422_1: C422.1 R92.1 T11.1(G)
NetC423_1: C423.1 D8.1(C) R93.1 T12.4(S)
NetIC16_1: IC16.1(~{RESET}) R87.1 ; port P12V0_OK
NetIC16_5: IC16.5(SENSE) R88.2 R89.1
NetIC18_5: IC18.5(FB) R77.2 R78.1
NetLD1_2: LD1.2(A) R76.1
NetLD2_2: LD2.2(A) R86.1
NetR72_1: R72.1 R91.2 T14.3(D)
NetR75_1: R75.1 R90.2 T13.3(D)
NetR79_1: R79.1 T22.2(B) T22.5(B) T22.6(C)
NetR80_2: R80.2 T10.1(G) T22.3(C)
NetR81_2: R81.2 R83.2 T23.2(B) T23.6(C)
NetR82_2: R82.2 T7.4(S) T23.3(C)
NetR83_1: R83.1 T23.5(B)
NetR85_1: R85.1 R92.2 T15.3(D)

Not connected (* = marked no-connect by the designer): IC18 4(NC) 7(PG)

### Buses and harness runs
harness port LTM_CTRL = sheet PWR_DC_DC_EXAR/LTM_CTRL

### Layout directives
net class PWR: FMC1_12P0V, I_FMC1_P12V0+, I_RTM_P12V0+, P3V3MP, P3V3MP_FUSE, P3V3MP_RTM, P3V3MP_SW, P12V0, P12V0_Molex, P12V0_RTM, PAYLOAD_PWR

### Notes on the sheet
- reverse protection
- (near J9) STAND-ALONE 12V POWER
  max 5A
- (near R525) surge protection
- (near T10) reverse protection
- (near IC18) 3.3V/0.5A
- (near IC18) 800mV
- IC16 threshold is set to 8.4V
- The recommended power-on sequence is VCCINT/VCCINT_IO, VCCBRAM, VCCAUX/VCCAUX_IO, and VCCO  to achieve minimum current draw and ensure that the I/Os are 3-stated at power-on. The recommended  power-off sequence is the reverse of the power-on sequence.  If VCCINT/VCCINT_IO and VCCBRAM have the  same recommended voltage levels, they can be powered by the same supply and ramped simultaneously.  VCCINT_IO must be connected to VCCINT.  If VCCAUX/VCCAUX_IO and VCCO have the same recommended  voltage levels, they can be powered by the same supply and ramped simultaneously. VCCAUX and V CCAUX_IO must be connected together. When the current minimums are met, the device powers on after the  VCCINT/VCCINT_IO, VCCBRAM, VCCAUX/VCCAUX_IO, and VCCO  supplies have all passed through their power-on reset threshold voltages. The device mu st not be configured until after VCCINT is applied.VCCADCand VREFcan be powered at any time and have  no power-up sequencing recommendations.The recommended power-on sequence to achieve mini mum current draw for the GTH or GTY transceivers  is VCCINT, VMGTAVCC, VMGTAVTT OR VMGTAVCC, VCCINT, VMGTAVTT . There is no recommended sequencing for VMGTVCCAUX. Both VMGTAVC and VCCINT  can be ramped simultaneously. The recommended power-off  sequence is the reverse of the power-on sequence to achieve minimum current draw. If these  recommended sequences are not met, current drawn from VMGTAVTT  can be higher than specifications during power-up and power-down.
- Project/Equipment
- Document
- Designer
- Drawn by
- Check.by
- Copyright WUT ISE 2018.
  This documentation describes Open Hardware and is licensed under the CERN OHL v.1.1. You may redistribute and modify this documentation under the terms of the CERN OHL v.1.1. (http://ohwr.org/CERNOHL). This documentation is distributed WITHOUT ANY EXPRESS OR IMPLIED WARRANTY, INCLUDING OF MERCHANTABILITY, SATISFACTORY QUALITY AND FITNESS FOR A PARTICULAR PURPOSE. Please see the CERN OHL v.1.1 for applicable conditions.
- Contact
- File
- Last Mod.
- Print Date
- Sheet
- Size
- A3
- of
- Rev
- (in symbol IRF9310PBF) G
- (in symbol R0402_1K_1%_0.0625W_100PPM) 1%
- (in symbol R0402_10K_1%_0.0625W_100PPM) 1%
- (in symbol R0402_47K_1%_0.0625W_100PPM) 1%
- (in symbol R0402_82K_1%_0.0625W_100PPM) 1%
- (in symbol R0402_100K_1%_0.0625W_100PPM) 1%
- (in symbol R0402_270K_1%_0.0625W_100PPM) 1%
- (in symbol R1206_0R47_1%_0.5W_600PPM) 1%
- (in symbol R2512_0R01_1%_1W_75PPM_VISHAY_WSL) 1%
- (in symbol R2512_0R02_1%_1W_75PPM_VISHAY_WSL) 1%

### Library data of the parts
C353 C415-C418 C420-C423 C521 C522 = CC0402_100NF_16V_10%_X5R: Non-polarised capacitor; Manufacturer: GENERIC; Part Description: SMD Multilayer Chip Ceramic Capacitor; Manufacturer1 Part Number: GRM155R61C104KA88D; Tolerance: ±10%; Voltage: 16V; TC: X5R; Manufacturer Part Number: CC0402_100NF_16V_10%_X5R; Part Number: CC0402_100NF_16V_10%_X5R; Value: 100nF; Component Kind: Standard; Component Type: Standard; Pin Count: 2; Status: None; Case: 0402; Mounted: Yes; Socket: No; SMD: Yes; Sense: No; Manufacturer1 Example: MURATA; Manufacturer1 ComponentHeight: 0.55mm; HelpURL: \\cern.ch\dfs\Applications\Altium\Datasheets\CC0402_X5R_MURATA_GRM.pdf; Author: CERN DEM JLC; CreateDate: 10.12.2013; LatestRevisionDate: 10.12.2013
C419 = CC0402_10NF_16V_10%_X7R: Non-polarised capacitor; Manufacturer: GENERIC; Part Description: SMD Multilayer Chip Ceramic Capacitor; Manufacturer1 Part Number: 223878715636; Tolerance: ±10%; Voltage: 16V; TC: X7R; Manufacturer Part Number: CC0402_10NF_16V_10%_X7R; Part Number: CC0402_10NF_16V_10%_X7R; Value: 10nF; Component Kind: Standard; Component Type: Standard; Pin Count: 2; Status: Not Recommended; Case: 0402; Mounted: Yes; Socket: No; SMD: Yes; Sense: No; Manufacturer1 Example: PHYCOMP; Manufacturer1 ComponentHeight: 0.55mm; HelpURL: \\cern.ch\dfs\Applications\Altium\Datasheets\CC0402_X7R_PHYCOMP.pdf; Author: CERN DEM JLC; CreateDate: 03.12.2007; LatestRevisionDate: 03.12.2007
C564 = CC0603_4.7UF_16V_10%_X5R: Non-polarised capacitor; Manufacturer: GENERIC; Part Description: SMD Multilayer Chip Ceramic Capacitor; Manufacturer1 Part Number: EMK107ABJ475KA-T; Tolerance: ±10%; Voltage: 16V; TC: X5R; Manufacturer Part Number: CC0603_4.7UF_16V_10%_X5R; Part Number: CC0603_4.7UF_16V_10%_X5R; Value: 4.7uF; Component Kind: Standard; Component Type: Standard; Pin Count: 2; Status: None; Case: 0603; Mounted: Yes; Socket: No; SMD: Yes; Sense: No; Manufacturer1 Example: TAIYO YUDEN; Manufacturer1 ComponentHeight: 0.95mm; HelpURL: \\cern.ch\dfs\Applications\Altium\Datasheets\CC0603_X7R_TAIYO-YUDEN_HIGH-VALUE.pdf; Author: CERN DEM JLC; CreateDate: 16.12.2013; LatestRevisionDate: 16.09.2014
C582 = CC1206_47UF_25V_20%_X5R: Non-polarised capacitor; Manufacturer: GENERIC; Part Description: SMD Multilayer Chip Ceramic Capacitor; Manufacturer1 Part Number: C3216X5R1E476M160AC; Tolerance: ±20%; Voltage: 25V; TC: X5R; Manufacturer Part Number: CC1206_47UF_25V_20%_X5R; Part Number: CC1206_47UF_25V_20%_X5R; Value: 47uF; Component Kind: Standard; Component Type: Standard; Pin Count: 2; Status: None; Case: 1206; Mounted: Yes; Socket: No; SMD: Yes; Sense: No; Manufacturer1 Example: TDK; Manufacturer1 ComponentHeight: 1.8mm; HelpURL: \\cern.ch\dfs\Applications\Altium\Datasheets\CC1206_X5R_TDK_C.pdf; Author: CERN DEM JLC; CreateDate: 20.11.2013; LatestRevisionDate: 14.03.2017
C634 = CC0805_22UF_16V_10%_X5R: Non-polarised capacitor; Manufacturer: GENERIC; Part Description: SMD Multilayer Chip Ceramic Capacitor; Manufacturer1 Part Number: C2012X5R1C226KT; Tolerance: ±10%; Voltage: 16V; TC: X5R; Manufacturer Part Number: CC0805_22UF_16V_10%_X5R; Part Number: CC0805_22UF_16V_10%_X5R; Value: 22uF; Component Kind: Standard; Component Type: Standard; Pin Count: 2; Status: Preferred; Case: 0805; Mounted: Yes; Socket: No; SMD: Yes; Sense: No; Manufacturer1 Example: TDK; Manufacturer1 ComponentHeight: 1.35mm; HelpURL: \\cern.ch\dfs\Applications\Altium\Datasheets\CC0805_X5R_TDK_C.pdf; Author: CERN DEM JLC; CreateDate: 25.10.2012; LatestRevisionDate: 25.10.2012
D8 = BAT165: Schottky Diode; Manufacturer: INFINEON; Part Description: Medium Power AF Schottky Diode; Voltage: 40V; Power: 750mA; PressFit: No; Bonding: No; Manufacturer Part Number: BAT165; PackageDescription: Small Outline Diode (SOD-323), 1.70mm W X 1.25mm L X 1.10mm H body,  IPC Medium Density; Part Number: BAT165; Component Kind: Standard; Component Type: Standard; Device: BAT165; Pin Count: 2; Case: SOD323; Mounted: Yes; Socket: No; SMD: Yes; Sense: No; ComponentHeight: 1.1mm; HelpURL: \\cern.ch\dfs\Applications\Altium\Datasheets\BAT165.pdf; Author: CERN DEM JLC; CreateDate: 12.11.2014; LatestRevisionDate: 12.11.2014
D30 = SS16: Schottky Diode; Manufacturer: VISHAY GENERAL SEMICONDUCTOR; Part Description: Surface Mount Schottky Barrier Rectifier; Voltage: 60V; Power: 1A; PressFit: No; Bonding: No; Manufacturer Part Number: SS16; PackageDescription: DO-214-AC Molded Diode, Body 5.1x2.7mm, IPC Medium Density; Part Number: SS16; Component Kind: Standard; Component Type: Standard; Device: SS16; Pin Count: 2; Case: DO-214AC; Mounted: Yes; Socket: No; SMD: Yes; Sense: No; ComponentHeight: 2.29mm; HelpURL: \\cern.ch\dfs\Applications\Altium\Datasheets\SS16.pdf; Author: CERN DEM JLC; CreateDate: 15.07.2008; LatestRevisionDate: 23.08.2010
D31 = P6SMB15A: Transient Voltage Suppressor Diode (Uni-Directional); Manufacturer: LITTELFUSE; Part Description: Uni-directional Transient Voltage Suppressor (TVS) Diode; Voltage: 15V; Power: 600W; PressFit: No; Bonding: No; Manufacturer Part Number: P6SMB15A; PackageDescription: DO-214-AA/SMB Diode, Molded Body; 5.40mm L X 3.62mm W X 2.61mm H, IPC Medium Density; Part Number: P6SMB15A; Component Kind: Standard; Component Type: Standard; Device: P6SMB15A; Pin Count: 2; Case: SMB; Mounted: Yes; Socket: No; SMD: Yes; Sense: No; ComponentHeight: 2.61mm; HelpURL: \\cern.ch\dfs\Applications\Altium\Datasheets\P6SMB15A.pdf; Author: CERN DEM JLC; CreateDate: 12.07.2017; LatestRevisionDate: 12.07.2017
F1 F2 = FUSR_LITTELFUSE_0805L010YR: Fuse; Part Description: POLYFUSE® Surface Mount Resettable PTC; PressFit: No; Manufacturer Part Number: 0805L010YR; Manufacturer: LITTELFUSE; PackageDescription: Surface Mount POLY-FUSE® Resettable PTC, 0805L Series; Part Number: FUSR_LITTELFUSE_0805L010YR; Value: 100mA-15V; Component Kind: Standard; Component Type: Standard; Pin Count: 2; Family: Fuses Resettable; Mounted: Yes; Socket: No; SMD: Yes; Sense: No; ComponentHeight: 1mm; HelpURL: \\cern.ch\dfs\Applications\Altium\Datasheets\FUSR_LITTELFUSE_0805L010YR.pdf; Author: CERN DEM JLC; CreateDate: 11.09.2012; LatestRevisionDate: 11.09.2012
IC16 = TPS3808G33DBVT: Low Quiescent Current, Programmable-Delay Supervisory Circuit; Manufacturer: TEXAS INSTRUMENTS; Part Description: 3.3V, Low Quiescent Current, Programmable-Delay Supervisory Circuit; PressFit: No; Bonding: No; Manufacturer Part Number: TPS3808G33DBVT; PackageDescription: SOT23, 6-Leads, Body 1.6x3.0mm, Pitch 0.95mm, IPC Medium Density; Part Number: TPS3808G33DBVT; Component Kind: Standard; Component Type: Standard; Device: TPS3808G33DBVT; Pin Count: 6; Case: SOT23-6; Mounted: Yes; Socket: No; SMD: Yes; Sense: No; ComponentHeight: 1.45mm; Author: CERN DEM JLC; HelpURL: \\cern.ch\dfs\Applications\Altium\Datasheets\TPS3808G33DBVT.pdf; CreateDate: 05.11.2013; LatestRevisionDate: 05.11.2013
IC18 = TPS62175DQC: 4.75-28VDC to 1-6VDC, 500mA Step-Down Converter With Sleep Mode; Manufacturer: TEXAS INSTRUMENTS; PressFit: No; Bonding: No; Manufacturer Part Number: TPS62175DQC; PackageDescription: SON, 10-Leads, Body 2x3mm, Pitch 0.5mm, Thermal Pad 0.94x2.5mm, IPC Medium Density; Part Description: 4.75-28VDC to 1-6VDC, 500mA Step-Down Converter With Sleep Mode; Part Number: TPS62175DQC; Component Kind: Standard; Component Type: Standard; Device: TPS62175DQC; Pin Count: 11; Case: SON10; Mounted: Yes; Socket: No; SMD: Yes; Sense: No; ComponentHeight: 0.8mm; HelpURL: \\cern.ch\dfs\Applications\Altium\Datasheets\TPS62175DQC.pdf; Author: CERN DEM JMW; CreateDate: 11.08.2015; LatestRevisionDate: 11.08.2015
IC55 IC56 = INA219BIDCNT: Zero-Drift, Bi-Directional CURRENT/POWER MONITOR with I2C™ Interface; Manufacturer: TEXAS INSTRUMENTS; PressFit: No; Bonding: No; Manufacturer Part Number: INA219BIDCNT; PackageDescription: SOT, 0.65mm pitch; 8 pin, 1.625mm W X 2.90mm L X 1.45mm H body, IPC Medium Density; Part Description: Zero-Drift, Bi-Directional CURRENT/POWER MONITOR with I2C™ Interface; Part Number: INA219BIDCNT; Component Kind: Standard; Component Type: Standard; Device: INA219BIDCNT; Pin Count: 8; Case: SOT23-8; Mounted: Yes; Socket: No; SMD: Yes; Sense: No; ComponentHeight: 1.45mm; Author: CERN DEM JLC; HelpURL: \\cern.ch\dfs\Applications\Altium\Datasheets\INA219BIDCNT.pdf; CreateDate: 24.09.2013; LatestRevisionDate: 24.09.2013
J9 = MOLEX_39-28-1043: Connector 4 Male; Manufacturer: MOLEX; Part Description: 4.20mm (.165") Pitch Mini-Fit Jr.™ Header, Dual Row, Vertical, without Snap-in Plastic Peg PCB Lock, 4 Circuits; PressFit: No; Part Number: MOLEX_39-28-1043; Component Kind: Standard; Component Type: Standard; Pin Count: 4; Family: Mini-Fit Jr.™; Mounted: Yes; Socket: No; SMD: No; Sense: No; Status: None; ComponentHeight: 13.1mm; HelpURL: \\cern.ch\dfs\Applications\Altium\Datasheets\MOLEX_39-28-1043.pdf; Author: CERN DEM JLC; CreateDate: 12.03.2009; LatestRevisionDate: 06.03.2012
L9 = IND_10UH_10%_MURATA-PS_8400: Inductor With Core; Manufacturer Part Number: 84103C; Manufacturer: MURATA POWER SOLUTIONS; Part Description: Miniature Surface Mount Power Inductor (8400 Series); Tolerance: ±10%; Power: 950mA; Resistance: 0.24R; Part Number: IND_10UH_10%_MURATA-PS_8400; Value: 10uH; Component Kind: Standard; Component Type: Standard; Pin Count: 2; Status: None; Mounted: Yes; Socket: No; SMD: Yes; Sense: No; ComponentHeight: 2.9mm; HelpURL: \\cern.ch\dfs\Applications\Altium\Datasheets\IND_MURATA-PS_8400.pdf; Author: CERN DEM JLC; CreateDate: 02.07.2012; LatestRevisionDate: 02.07.2012
LD1 LD2 = LED_KINGBRIGHT_KPH-1608CGCK: LED Green 1C 2A; Part Description: SMD Green LED, Case 1.6mmX0.8mm(0603), 0.65mm Thickness; PressFit: No; Bonding: No; Manufacturer Part Number: KPH-1608CGCK; Manufacturer: KINGBRIGHT; PackageDescription: SMT Green LED, Case 0603, Body L 1.6 x W 0.8mm H 0.65mm; Part Number: LED_KINGBRIGHT_KPH-1608CGCK; Component Kind: Standard; Component Type: Standard; Color: Green; Pin Count: 2; Mounted: Yes; Socket: No; SMD: Yes; Sense: No; ComponentHeight: 0.65mm; HelpURL: \\cern.ch\dfs\Applications\Altium\Datasheets\LED_KINGBRIGHT_KPH-1608CGCK.pdf; Author: CERN DEM JLC; CreateDate: 03.07.2017; LatestRevisionDate: 03.07.2017
R72-R76 R79 R84-R87 R90 R91 R93 = R0402_10K_1%_0.0625W_100PPM: as R139 on sheet SDRAM_DDR3_2x16; Manufacturer Part Number: R0402_10K_1%_0.0625W_100PPM; Part Number: R0402_10K_1%_0.0625W_100PPM; Tolerance: ±1%; Value: 10k; Component Kind: Standard; Component Type: Standard; Pin Count: 2; Status: Not Recommended; Power: 0.0625W; Case: 0402; Mounted: Yes; Sense: No; Socket: No; SMD: Yes; Manufacturer1 Example: YAGEO PHYCOMP; Manufacturer1 ComponentHeight: 0.4mm; HelpURL: \\cern.ch\dfs\Applications\Altium\Datasheets\R0402_Phycomp_RC0402.pdf; Author: CERN DEM JLC; CreateDate: 03.12.2007; LatestRevisionDate: 17.10.2012
R77 R82 R89 = R0402_82K_1%_0.0625W_100PPM: Resistor - 1%; Manufacturer: GENERIC; Part Description: General Purpose Thick Film Chip Resistor; Manufacturer1 Part Number: 232270678203L; TC: ±100ppm/°C; PressFit: No; Manufacturer Part Number: R0402_82K_1%_0.0625W_100PPM; Part Number: R0402_82K_1%_0.0625W_100PPM; Tolerance: ±1%; Value: 82k; Component Kind: Standard; Component Type: Standard; Pin Count: 2; Status: Not Recommended; Power: 0.0625W; Case: 0402; Mounted: Yes; Sense: No; Socket: No; SMD: Yes; Manufacturer1 Example: YAGEO PHYCOMP; Manufacturer1 ComponentHeight: 0.4mm; HelpURL: \\cern.ch\dfs\Applications\Altium\Datasheets\R0402_Phycomp_RC0402.pdf; Author: CERN DEM JLC; CreateDate: 03.12.2007; LatestRevisionDate: 17.10.2012
R78 = R0402_270K_1%_0.0625W_100PPM: Resistor - 1%; Manufacturer: GENERIC; Part Description: General Purpose Thick Film Chip Resistor; Manufacturer1 Part Number: 232270672704L; TC: ±100ppm/°C; PressFit: No; Manufacturer Part Number: R0402_270K_1%_0.0625W_100PPM; Part Number: R0402_270K_1%_0.0625W_100PPM; Tolerance: ±1%; Value: 270k; Component Kind: Standard; Component Type: Standard; Pin Count: 2; Status: Not Recommended; Power: 0.0625W; Case: 0402; Mounted: Yes; Sense: No; Socket: No; SMD: Yes; Manufacturer1 Example: YAGEO PHYCOMP; Manufacturer1 ComponentHeight: 0.4mm; HelpURL: \\cern.ch\dfs\Applications\Altium\Datasheets\R0402_Phycomp_RC0402.pdf; Author: CERN DEM JLC; CreateDate: 03.12.2007; LatestRevisionDate: 17.10.2012
R80 R81 R88 = R0402_47K_1%_0.0625W_100PPM: Resistor - 1%; Manufacturer: GENERIC; Part Description: General Purpose Thick Film Chip Resistor; Manufacturer1 Part Number: 232270675103L; TC: ±100ppm/°C; PressFit: No; Manufacturer Part Number: R0402_47K_1%_0.0625W_100PPM; Part Number: R0402_47K_1%_0.0625W_100PPM; Tolerance: ±1%; Value: 47k; Component Kind: Standard; Component Type: Standard; Pin Count: 2; Status: Not Recommended; Power: 0.0625W; Case: 0402; Mounted: Yes; Sense: No; Socket: No; SMD: Yes; Manufacturer1 Example: YAGEO PHYCOMP; Manufacturer1 ComponentHeight: 0.4mm; HelpURL: \\cern.ch\dfs\Applications\Altium\Datasheets\R0402_Phycomp_RC0402.pdf; Author: CERN DEM JLC; CreateDate: 03.12.2007; LatestRevisionDate: 17.10.2012
R83 = R0402_1K_1%_0.0625W_100PPM: Resistor - 1%; Manufacturer: GENERIC; Part Description: General Purpose Thick Film Chip Resistor; Manufacturer1 Part Number: 232270671002L; TC: ±100ppm/°C; PressFit: No; Manufacturer Part Number: R0402_1K_1%_0.0625W_100PPM; Part Number: R0402_1K_1%_0.0625W_100PPM; Tolerance: ±1%; Value: 1k; Component Kind: Standard; Component Type: Standard; Pin Count: 2; Status: Not Recommended; Power: 0.0625W; Case: 0402; Mounted: Yes; Sense: No; Socket: No; SMD: Yes; Manufacturer1 Example: YAGEO PHYCOMP; Manufacturer1 ComponentHeight: 0.4mm; HelpURL: \\cern.ch\dfs\Applications\Altium\Datasheets\R0402_Phycomp_RC0402.pdf; Author: CERN DEM JLC; CreateDate: 03.12.2007; LatestRevisionDate: 17.10.2012
R92 = R0402_100K_1%_0.0625W_100PPM: Resistor - 1%; Manufacturer: GENERIC; Part Description: General Purpose Thick Film Chip Resistor; Manufacturer1 Part Number: 232270671004L; TC: ±100ppm/°C; PressFit: No; Manufacturer Part Number: R0402_100K_1%_0.0625W_100PPM; Part Number: R0402_100K_1%_0.0625W_100PPM; Tolerance: ±1%; Value: 100k; Component Kind: Standard; Component Type: Standard; Pin Count: 2; Status: Not Recommended; Power: 0.0625W; Case: 0402; Mounted: Yes; Sense: No; Socket: No; SMD: Yes; Manufacturer1 Example: YAGEO PHYCOMP; Manufacturer1 ComponentHeight: 0.4mm; HelpURL: \\cern.ch\dfs\Applications\Altium\Datasheets\R0402_Phycomp_RC0402.pdf; Author: CERN DEM JLC; CreateDate: 2007-12-03; LatestRevisionDate: 2012-10-17
R522 = R2512_0R02_1%_1W_75PPM_VISHAY_WSL: Resistor - 1%; Manufacturer Part Number: WSL2512R0200FEA; Manufacturer: VISHAY DALE; Part Description: Power Metal Strip® Resistor; Power: 1W; TC: ±75ppm/°C; PressFit: No; Part Number: R2512_0R02_1%_1W_75PPM_VISHAY_WSL; Tolerance: ±1%; Value: 0R02; Component Kind: Standard; Component Type: Standard; Pin Count: 2; Status: None; Case: 2512; Mounted: Yes; Sense: No; Socket: No; SMD: Yes; ComponentHeight: 0.89mm; HelpURL: \\cern.ch\dfs\Applications\Altium\Datasheets\R2512_VISHAY_WSL.pdf; Author: CERN DEM JLC; CreateDate: 17.11.2011; LatestRevisionDate: 23.10.2017
R523 = R2512_0R01_1%_1W_75PPM_VISHAY_WSL: Resistor - 1%; Manufacturer Part Number: WSL2512R0100FEA; Manufacturer: VISHAY DALE; Part Description: Power Metal Strip® Resistor; Power: 1W; TC: ±75ppm/°C; PressFit: No; Part Number: R2512_0R01_1%_1W_75PPM_VISHAY_WSL; Tolerance: ±1%; Value: 0R01; Component Kind: Standard; Component Type: Standard; Pin Count: 2; Status: None; Case: 2512; Mounted: Yes; Sense: No; Socket: No; SMD: Yes; ComponentHeight: 0.89mm; HelpURL: \\cern.ch\dfs\Applications\Altium\Datasheets\R2512_VISHAY_WSL.pdf; Author: CERN DEM JLC; CreateDate: 17.11.2011; LatestRevisionDate: 23.10.2017
R524 = R0805_NO-VALUE: Resistor; Part Description: Reserved Footprint For a 0805 (2012) Chip Resistor; PressFit: No; Mounted: No; Manufacturer Part Number: R0805_NO-VALUE; Manufacturer: Undefined; Part Number: R0805_NO-VALUE; Value: Undefined; Component Kind: Standard; Component Type: Standard; Pin Count: 2; Status: None; Case: 0805; Sense: No; Socket: No; SMD: Yes; Manufacturer1 Example: Undefined; Manufacturer1 Part Number: Undefined; Manufacturer1 ComponentHeight: Undefined; HelpURL: Undefined; Author: CERN DEM JLC; CreateDate: 03.12.2007; LatestRevisionDate: 13.03.2008
R525 = R1206_0R47_1%_0.5W_600PPM: Resistor - 1%; Manufacturer Part Number: RL1206FR-7W0R47  (35051914707); Manufacturer: YAGEO PHYCOMP; Part Description: Low Ohmique High Power Chip Resistor; Power: 0.5W; TC: ±600ppm/°C; PressFit: No; Part Number: R1206_0R47_1%_0.5W_600PPM; Tolerance: ±1%; Value: 0R47; Component Kind: Standard; Component Type: Standard; Pin Count: 2; Status: Not Recommended; Case: 1206; Mounted: Yes; Sense: No; Socket: No; SMD: Yes; ComponentHeight: 0.65mm; HelpURL: \\cern.ch\dfs\Applications\Altium\Datasheets\R1206_PHYCOMP_LRC02P.pdf; Author: CERN DEM JLC; CreateDate: 22.04.2010; LatestRevisionDate: 22.04.2010
T7-T9 T12 = IRF9310PBF: -30V -20A P-Channel HEXFET® Power MOSFET; Manufacturer: INTERNATIONAL RECTIFIER; PressFit: No; Bonding: No; Part Number: IRF9310PBF; Component Kind: Standard; Component Type: Standard; Device: IRF9310PBF; PackageDescription: SOIC 8, Pitch 1.27mm - Body 4x5mm, IPC Medium Density; Part Description: -30V -20A P-Channel HEXFET® Power MOSFET; Manufacturer Part Number: IRF9310PBF; Pin Count: 8; Case: SOIC8; Mounted: Yes; Socket: No; SMD: Yes; Sense: No; ComponentHeight: 1.75mm; HelpURL: \\cern.ch\dfs\Applications\Altium\Datasheets\IRF9310PBF.pdf; Author: CERN DEM JLC; CreateDate: 09.11.2016; LatestRevisionDate: 09.11.2016
T10 T11 = Si2315BDS-T1-E3: P-CHANNEL MOSFET WITH DIODE; Part Description: -12V -3A P-Channel STripFET® II Power MOSFET; Manufacturer: VISHAY SILICONIX; PressFit: No; Bonding: No; Part Number: Si2315BDS-T1-E3; Component Kind: Standard; Component Type: Standard; Device: Si2315BDS-T1-E3; PackageDescription: SOT, 0.95mm, pitch; 3 pin,1.30mm W X 2.92mm L X 1.12mm H body, IPC Medium Density; Manufacturer Part Number: Si2315BDS-T1-E3; Pin Count: 3; Case: SOT23-3; Mounted: Yes; Socket: No; SMD: Yes; Sense: No; ComponentHeight: 1.12mm; HelpURL: \\cern.ch\dfs\Applications\Altium\Datasheets\Si2315BDS-T1-E3.pdf; Author: CERN DEM JLC; CreateDate: 02.05.2011; LatestRevisionDate: 02.05.2011
T13-T15 = BSS138LT1G: N-CHANNEL MOSFET WITH DIODE; Manufacturer: ON SEMICONDUCTOR; Part Description: 50V 200mA N-Channel Enhancement Mode Field-Effect Transistor; PressFit: No; Bonding: No; Manufacturer Part Number: BSS138LT1G; PackageDescription: SOT23 3-Leads, Pitch 0.95mm - Body 1.4x3mm, IPC Medium Density; Part Number: BSS138LT1G; Component Kind: Standard; Component Type: Standard; Device: BSS138LT1G; Pin Count: 3; Case: SOT23-3; Mounted: Yes; Socket: No; SMD: Yes; Sense: No; ComponentHeight: 1.11mm; HelpURL: \\cern.ch\dfs\Applications\Altium\Datasheets\BSS138LT1G.pdf; Author: CERN DEM JLC; CreateDate: 23.03.2009; LatestRevisionDate: 23.03.2009
T22 T23 = BC857BV: 45V, 100mA PNP General Purpose Double Transistor; Manufacturer: NXP SEMICONDUCTORS; Part Description: -45V -100mA PNP General Purpose Double Transistor; PressFit: No; Bonding: No; Manufacturer Part Number: BC857BV; PackageDescription: SOTFL (SOT666), 0.50mm, Pitch; 6 Pin, 1.20mm W X 1.60mm L X 0.60mm H Body, IPC Medium Density; Part Number: BC857BV; Component Kind: Standard; Component Type: Standard; Device: BC857BV; Pin Count: 6; Case: SOT666; Mounted: Yes; Socket: No; SMD: Yes; Sense: No; ComponentHeight: 0.6mm; HelpURL: \\cern.ch\dfs\Applications\Altium\Datasheets\BC857BV.pdf; Author: CERN DEM JLC; CreateDate: 01.12.2011; LatestRevisionDate: 01.12.2011